# EAGLE design RomiboShield (EAGLE 5.11)
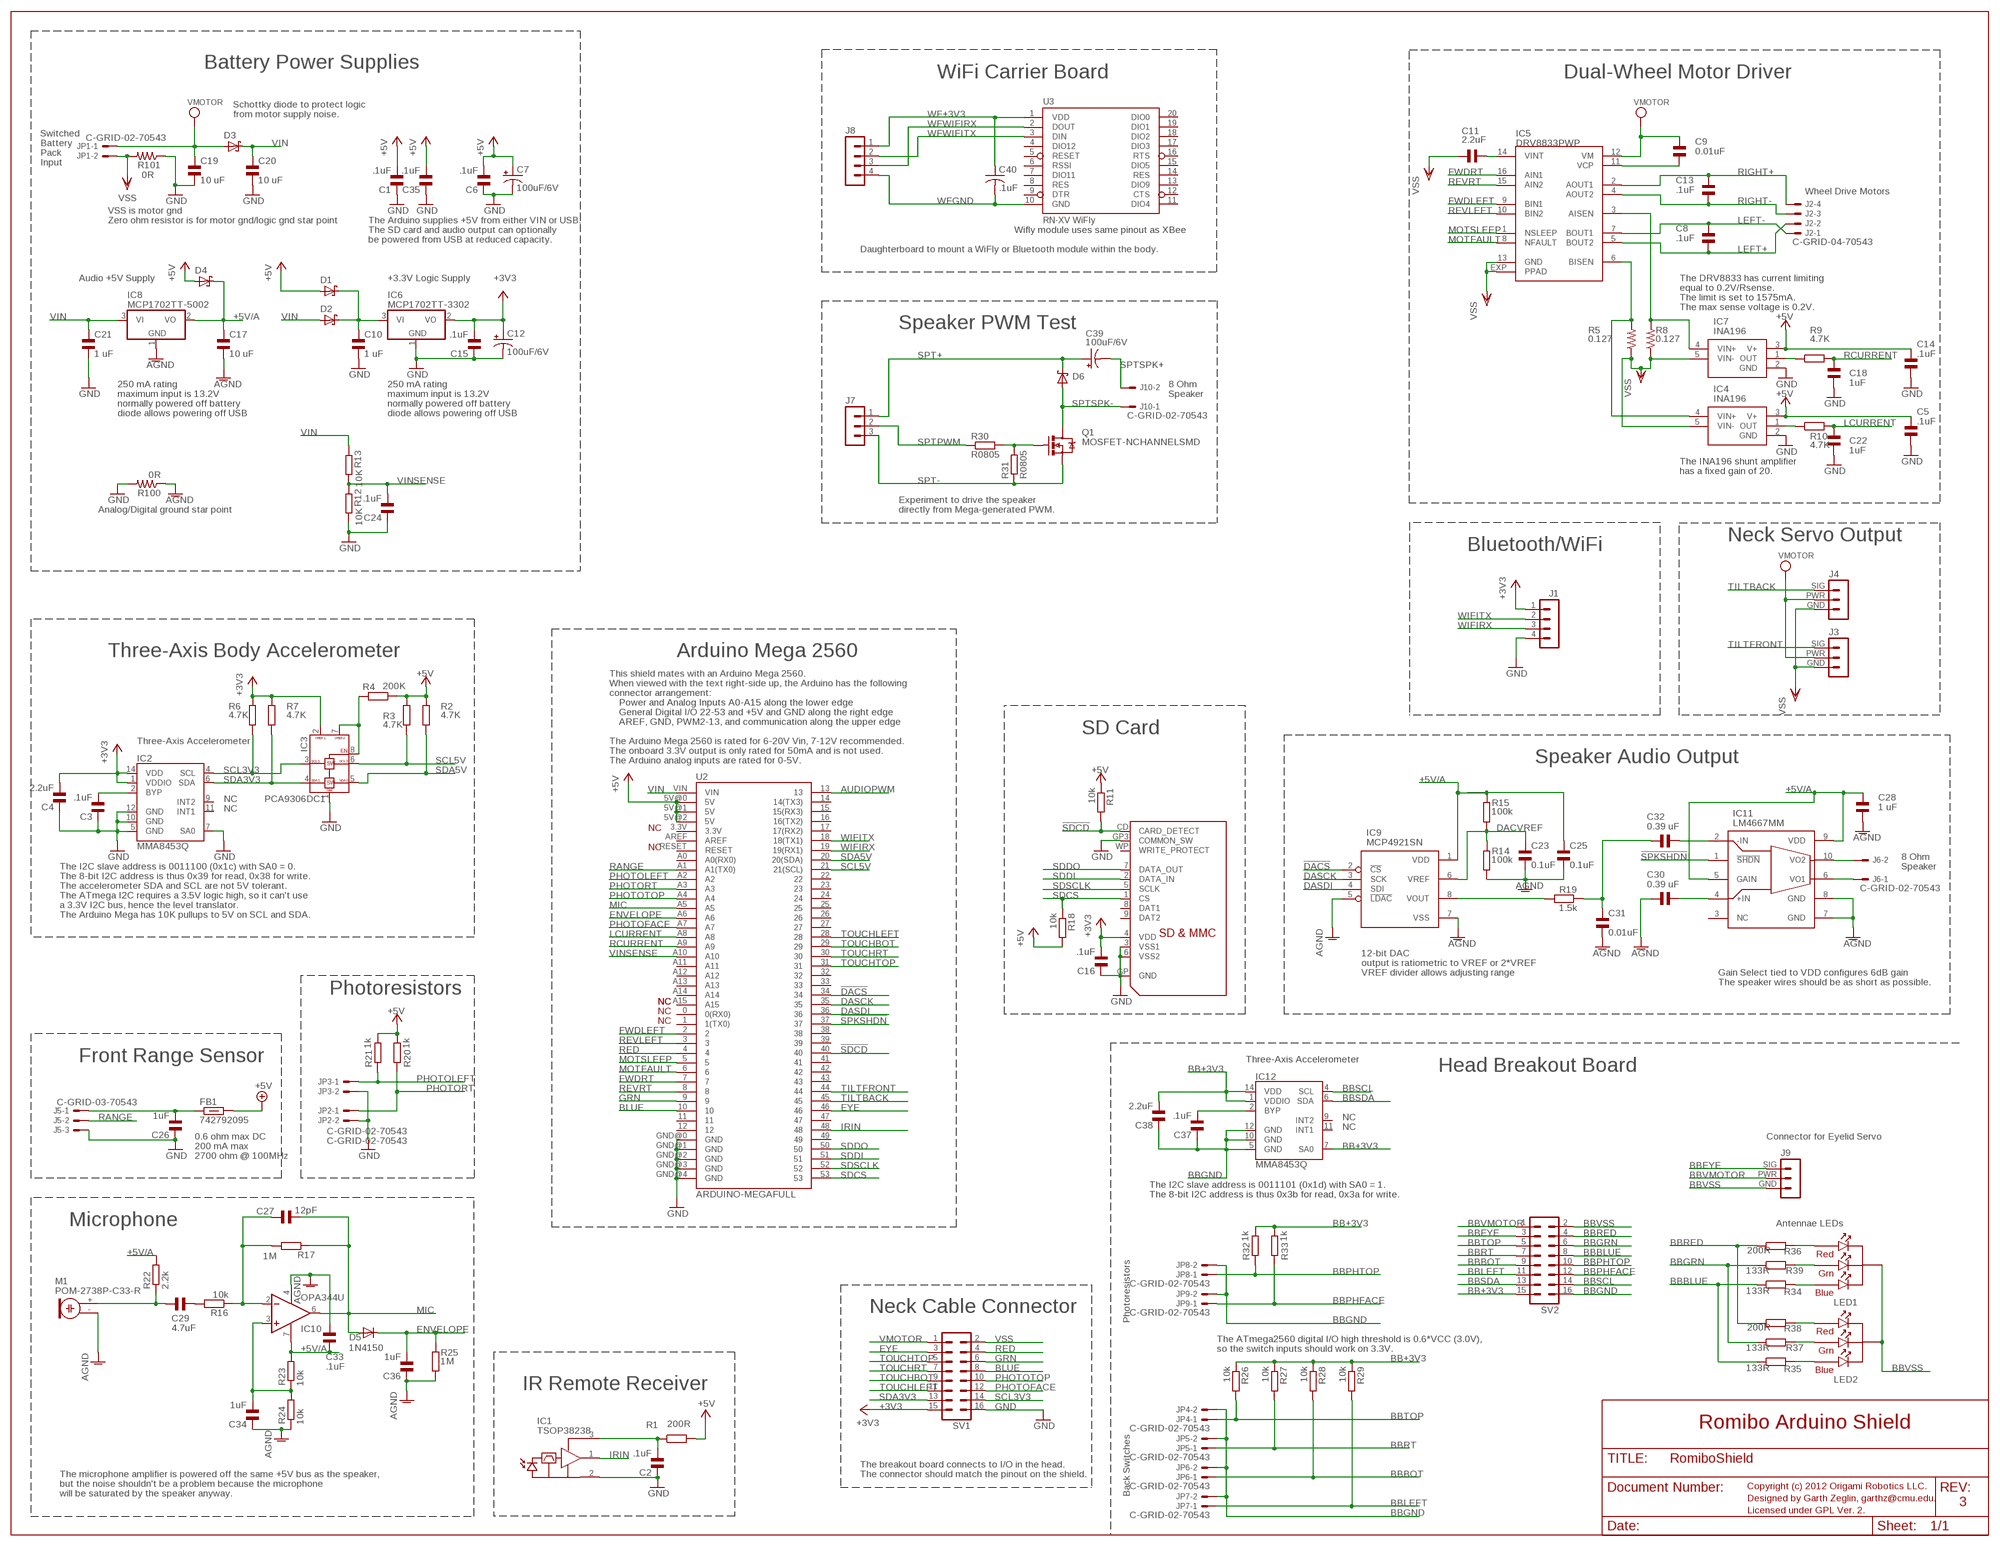
[diagram p0: schematic, sheet 1]

## Parts
C1  .1uF  C0805  [C0805]
C2  .1uF  C0805  [C0805]
C3  .1uF  C0805  [C0805]
C4  2.2uF  C0805  [C0805]
C5  .1uF  C0805  [C0805]
C6  .1uF  C0805  [C0805]
C7  100uF/6V  CPOL-USE2.5-5  [E2,5-5]
C8  .1uF  C0805  [C0805]
C9  0.01uF  C0805  [C0805]
C10  1 uF  C0805  [C0805]
C11  2.2uF  C0805  [C0805]
C12  100uF/6V  CPOL-USE2.5-5  [E2,5-5]
C13  .1uF  C0805  [C0805]
C14  .1uF  C0805  [C0805]
C15  .1uF  C0805  [C0805]
C16  .1uF  C0805  [C0805]
C17  10 uF  C0805  [C0805]
C18  1uF  C0805  [C0805]
C19  10 uF  C0805  [C0805]
C20  10 uF  C0805  [C0805]
C21  1 uF  C0805  [C0805]
C22  1uF  C0805  [C0805]
C23  0.1uF  C0805  [C0805]
C24  .1uF  C0805  [C0805]
C25  0.1uF  C0805  [C0805]
C26  1uF  C0805  [C0805]
C27  12pF  C0805  [C0805]
C28  1 uF  C0805  [C0805]
C29  4.7uF  C0805  [C0805]
C30  0.39 uF  C0805  [C0805]
C31  0.01uF  C0805  [C0805]
C32  0.39 uF  C0805  [C0805]
C33  .1uF  C0805  [C0805]
C34  1uF  C0805  [C0805]
C35  .1uF  C0805  [C0805]
C36  1uF  C0805  [C0805]
C37  .1uF  C0805  [C0805]
C38  2.2uF  C0805  [C0805]
C39  100uF/6V  CPOL-USE2.5-5  [E2,5-5]
C40  .1uF  C-USC0805  [C0805]
D1  MBR120  [SOD-123]
D2  MBR120  [SOD-123]
D3  MBR120  [SOD-123]
D4  MBR120  [SOD-123]
D5  1N4150  DIODE-SOD123  [SOD123]
D6  MBR130  [SOD-123]
FB1  742792095  FB0805  [FB0805]
IC1  TSOP38238  [TSOP382]
IC2  MMA8453Q  MMA8452Q  [QFN-16_0.5MM]
IC3  PCA9306DC1  [VSSOP8]
IC4  INA196  [SOT23-DBV]
IC5  DRV8833PWP  [HTSSOPPWP16]
IC6  MCP1702TT-3302  MCP1702TT  [SOT23]
IC7  INA196  [SOT23-DBV]
IC8  MCP1702TT-5002  MCP1702TT  [SOT23]
IC9  MCP4921SN  [SO-08]
IC10  OPA344U  [SO08]
IC11  LM4667MM  [MSOP-10]
IC12  MMA8453Q  MMA8452Q  [QFN-16_0.5MM]
J1  MA04-1F  [MA04-1F]
J2  C-GRID-04-70543  [70543-04]
J3  SERVOCONN  [SERVOCONN]
J4  SERVOCONN  [SERVOCONN]
J5  C-GRID-03-70543  [70543-03]
J6  C-GRID-02-70543  [70543-02]
J7  MA03-1F  [MA03-1F]
J8  MA04-1F  [MA04-1F]
J9  SERVOCONN  [SERVOCONN]
J10  C-GRID-02-70543  [70543-02]
JP1  C-GRID-02-70543  [70543-02]
JP2  C-GRID-02-70543  [70543-02]
JP3  C-GRID-02-70543  [70543-02]
JP4  C-GRID-02-70543  [70543-02]
JP5  C-GRID-02-70543  [70543-02]
JP6  C-GRID-02-70543  [70543-02]
JP7  C-GRID-02-70543  [70543-02]
JP8  C-GRID-02-70543  [70543-02]
JP9  C-GRID-02-70543  [70543-02]
LED1  RGBLED_CC-5MM  [LED5MMRGB]
LED2  RGBLED_CC-5MM  [LED5MMRGB]
M1  POM-2738P-C33-R  [POM-2738P-C33-R]
Q1  MOSFET-NCHANNELSMD  [SOT23-3]
R1  200R  R0603  [R0603]
R2  4.7K  R0603  [R0603]
R3  4.7K  R0603  [R0603]
R4  200K  R0603  [R0603]
R5  0.127  R-US_R1210  [R1210]
R6  4.7K  R0603  [R0603]
R7  4.7K  R0603  [R0603]
R8  0.127  R-US_R1210  [R1210]
R9  4.7K  R0603  [R0603]
R10  4.7K  R0603  [R0603]
R11  10k  R0603  [R0603]
R12  10K  R0603  [R0603]
R13  10K  R0603  [R0603]
R14  100k  R0603  [R0603]
R15  100k  R0603  [R0603]
R16  10k  R0603  [R0603]
R17  1M  R0603  [R0603]
R18  10k  R0603  [R0603]
R19  1.5k  R0603  [R0603]
R20  1k  R0603  [R0603]
R21  1k  R0603  [R0603]
R22  2.2k  R0603  [R0603]
R23  10k  R0603  [R0603]
R24  10k  R0603  [R0603]
R25  1M  R0603  [R0603]
R26  10k  R0603  [R0603]
R27  10k  R0603  [R0603]
R28  10k  R0603  [R0603]
R29  10k  R0603  [R0603]
R30  R0805  [R0805]
R31  R0805  [R0805]
R32  1k  R0603  [R0603]
R33  1k  R0603  [R0603]
R34  133R  R0603  [R0603]
R35  133R  R0603  [R0603]
R36  200R  R0603  [R0603]
R37  133R  R0603  [R0603]
R38  200R  R0603  [R0603]
R39  133R  R0603  [R0603]
R100  0R  R-US_R0805  [R0805]
R101  0R  R-US_R0805  [R0805]
SV1  ML16  [ML16]
SV2  ML16  [ML16]
U1  SDMMC06132  [06132]
U2  ARDUINO-MEGAFULL  [ARDUINO_MEGA]
U3  RN-XV WiFly  XBEE-1B2  [XBEE-SILK]

## Nets
3VREGIN: C10.2 D1.1(K) D2.1(K) IC6.3(VI)
!DACS: IC9.2(!CS!) U2.34
!SDCD: R11.2 U1.CD(CARD_DETECT) U2.40
!SPKSHDN: IC11.1(!SHDN!) U2.37
+3V3: C4.1 C12.+ C15.1 C16.1 IC2.1(VDDIO) IC2.14(VDD) IC3.2(VREF1) IC6.2(VO) J1.1 R6.2 R7.2 SV1.15 U1.4(VDD)
+5V: C1.1 C5.1 C6.1 C7.+ C14.1 C35.1 D1.2(A) D4.2(A) FB1.2 IC4.3(V+) IC7.3(V+) R1.2 R2.2 R3.2 R4.1 R11.1 R18.2 R20.2 R21.2 U2.5V@0(5V) U2.5V@1(5V) U2.5V@2(5V)
+5V/A: C17.2 C25.1 C28.1 C33.2 D4.1(K) IC8.2(VO) IC9.1(VDD) IC10.7(V+) IC11.5(GAIN) IC11.9(VDD) R15.1 R22.2 R23.2
AGND: C17.1 C23.2 C25.2 C28.2 C30.1 C31.2 C33.1 C34.2 C36.2 IC8.1(GND) IC9.5(!LDAC!) IC9.7(VSS) IC10.4(V-) IC11.7(GND) IC11.8(GND) M1.- R14.2 R24.1 R25.1 R100.1
ASENSE: IC5.3(AISEN) IC7.4(VIN+) R8.2
AUDIO: C31.1 C32.1 R19.1
AUDIOPWM: U2.13
BB+3V3: C38.1 IC12.1(VDDIO) IC12.7(SA0) IC12.14(VDD) R26.1 R27.1 R28.1 R29.1 R32.2 R33.2 SV2.15
BBBLUE: R34.1 R35.1 SV2.8
BBBOT: JP6.1 R28.2 SV2.9
BBBYP: C37.1 IC12.2(BYP)
BBEYE: J9.SIG SV2.3
BBGND: C37.2 C38.2 IC12.5(GND) IC12.10(GND) IC12.12(GND) JP4.2 JP5.2 JP6.2 JP7.2 JP8.2 JP9.2 SV2.16
BBGRN: R37.1 R39.1 SV2.6
BBLEFT: JP7.1 R29.2 SV2.11
BBPHFACE: JP9.1 R33.1 SV2.12
BBPHTOP: JP8.1 R32.1 SV2.10
BBRED: R36.1 R38.1 SV2.4
BBRT: JP5.1 R27.2 SV2.7
BBSCL: IC12.4(SCL) SV2.14
BBSDA: IC12.6(SDA) SV2.13
BBTOP: JP4.1 R26.2 SV2.5
BBVMOTOR: J9.PWR SV2.1
BBVSS: J9.GND LED1.2(COM) LED2.2(COM) SV2.2
BLUE: SV1.8 U2.10
BSENSE: IC4.4(VIN+) IC5.6(BISEN) R5.2
DACOUT: IC9.8(VOUT) R19.2
DACVREF: C23.1 IC9.6(VREF) R14.1 R15.2
DASCK: IC9.3(SCK) U2.35
DASDI: IC9.4(SDI) U2.36
ENVELOPE: C36.1 D5.C R25.2 U2.A6
EYE: SV1.3 U2.46
FWDLEFT: IC5.9(BIN1) U2.2
FWDRT: IC5.16(AIN1) U2.7
GND: C1.2 C2.2 C3.2 C4.2 C5.2 C6.2 C7.- C10.1 C12.- C14.2 C15.2 C16.2 C18.2 C19.1 C20.1 C21.1 C22.2 C24.2 C26.2 C35.2 IC1.2(GND) IC2.5(GND) IC2.7(SA0) IC2.10(GND) IC2.12(GND) IC3.1(GND) IC4.2(GND) IC6.1(GND) IC7.2(GND) J1.4 J5.3 JP2.2 JP3.2 R12.2 R100.2 R101.1 SV1.16 U1.3(VSS1) U1.6(VSS2) U1.GP3(COMMON_SW) U1.GP(GND) U2.GND@0(GND) U2.GND@1(GND) U2.GND@2(GND) U2.GND@3(GND) U2.GND@4(GND)
GRN: SV1.6 U2.9
IR+5V: C2.1 IC1.3(VS) R1.1
IRIN: IC1.1(OUT) U2.48
LCURRENT: C22.1 R10.2 U2.A8
LEFT+: C8.2 IC5.5(BOUT2) J2.2
LEFT-: C8.1 IC5.7(BOUT1) J2.1
LIOUT: IC7.1(OUT) R9.1
MIC: C27.1 D5.A IC10.6(OUT) R17.1 U2.A5
MIC+: C29.2 M1.+ R22.1
MICOP+: C34.1 IC10.3(+IN) R23.1 R24.2
MICOP-: C27.2 IC10.2(-IN) R16.1 R17.2
MOTFAULT: IC5.8(NFAULT) U2.6
MOTSLEEP: IC5.1(NSLEEP) U2.5
MOTVINT: C11.1 IC5.14(VINT)
N$1: C9.2 IC5.11(VCP)
N$4: IC3.7(VREF2) IC3.8(EN) R4.2
N$7: LED1.3(BLUE) R34.2
N$8: LED1.4(GREEN) R39.2
N$9: LED1.1(RED) R36.2
N$10: C3.1 IC2.2(BYP)
N$53: C29.1 R16.2
N$61: LED2.3(BLUE) R35.2
N$64: LED2.4(GREEN) R37.2
N$65: LED2.1(RED) R38.2
PHOTOFACE: SV1.12 U2.A7
PHOTOLEFT: JP3.1 R21.1 U2.A2
PHOTORT: JP2.1 R20.1 U2.A3
PHOTOTOP: SV1.10 U2.A4
RANGE: J5.2 U2.A1(A1(TX0))
RANGE+5V: C26.1 FB1.1 J5.1
RCURRENT: C18.1 R9.2 U2.A9
RED: SV1.4 U2.4
REVLEFT: IC5.10(BIN2) U2.3
REVRT: IC5.15(AIN2) U2.8
RIGHT+: C13.1 IC5.2(AOUT1) J2.4
RIGHT-: C13.2 IC5.4(AOUT2) J2.3
RIOUT: IC4.1(OUT) R10.1
SCL3V3: IC2.4(SCL) IC3.3(SCL1) R6.1 SV1.14
SCL5V: IC3.6(SCL2) R3.1 U2.21(21(SCL))
SDA3V3: IC2.6(SDA) IC3.4(SDA1) R7.1 SV1.13
SDA5V: IC3.5(SDA2) R2.1 U2.20(20(SDA))
SDCS: R18.1 U1.1(CS) U2.53
SDDI: U1.2(DATA_IN) U2.51
SDDO: U1.7(DATA_OUT) U2.50
SDSCLK: U1.5(SCLK) U2.52
SPK+: IC11.10(VO2) J6.2
SPK-: IC11.6(VO1) J6.1
SPKDRV+: C30.2 IC11.4(+IN)
SPKDRV-: C32.2 IC11.2(-IN)
SPKTBASE: Q1.1(G) R30.2 R31.2
SPT+: C39.+ D6.1(K) J7.1
SPT-: J7.3 Q1.2(S) R31.1
SPTPWM: J7.2 R30.1
SPTSPK+: C39.- J10.2
SPTSPK-: D6.2(A) J10.1 Q1.3(D)
TILTBACK: J4.SIG U2.45
TILTFRONT: J3.SIG U2.44
TOUCHBOT: SV1.9 U2.29
TOUCHLEFT: SV1.11 U2.28
TOUCHRT: SV1.7 U2.30
TOUCHTOP: SV1.5 U2.31
VIN: C20.2 C21.2 D2.2(A) D3.1(K) IC8.3(VI) R13.1 U2.VIN
VINSENSE: C24.1 R12.1 R13.2 U2.A10
VMOTOR: C9.1 C19.2 D3.2(A) IC5.12(VM) J3.PWR J4.PWR JP1.1 SV1.1
VSS: C11.2 IC4.5(VIN-) IC5.13(GND) IC5.EXP(PPAD) IC7.5(VIN-) J3.GND J4.GND JP1.2 R5.1 R8.1 R101.2 SV1.2
WF+3V3: C40.1 J8.1 U3.1(VDD)
WFGND: C40.2 J8.4 U3.10(GND)
WFWIFIRX: J8.3 U3.2(DOUT)
WFWIFITX: J8.2 U3.3(DIN)
WIFIRX: J1.3 U2.19(19(RX1))
WIFITX: J1.2 U2.18(18(TX1))
Unconnected: IC2.9(INT2) IC2.11(INT1) IC11.3(NC) IC12.9(INT2) IC12.11(INT1) U1.8(DAT1) U1.9(DAT2) U1.WP(WRITE_PROTECT) U2.0(0(RX0)) U2.1(1(TX0)) U2.3.3V U2.11 U2.12 U2.14(14(TX3)) U2.15(15(RX3)) U2.16(16(TX2)) U2.17(17(RX2)) U2.22 U2.23 U2.24 U2.25 U2.26 U2.27 U2.32 U2.33 U2.38 U2.39 U2.41 U2.42 U2.43 U2.47 U2.49 U2.A0(A0(RX0)) U2.A11 U2.A12 U2.A13 U2.A14 U2.A15 U2.AREF U2.RESET U3.4(DIO12) U3.5(RESET) U3.6(RSSI) U3.7(DIO11) U3.8(RES) U3.9(DTR) U3.11(DIO4) U3.12(CTS) U3.13(DIO9) U3.14(RES) U3.15(DIO5) U3.16(RTS) U3.17(DIO3) U3.18(DIO2) U3.19(DIO1) U3.20(DIO0)

## Notes on the sheet
- Battery Power Supplies
- WiFi Carrier Board | Dual-Wheel Motor Driver
- Schottky diode to protect logic
- from motor supply noise.
- Switched
- Battery
- Pack
- Input
- Wheel Drive Motors
- VSS is motor gnd
- Zero ohm resistor is for motor gnd/logic gnd star point | The Arduino supplies +5V from either VIN or USB.
- The SD card and audio output can optionally | Wifly module uses same pinout as XBee
- be powered from USB at reduced capacity.
- Daughterboard to mount a WiFly or Bluetooth module within the body.
- Audio +5V Supply | +3.3V Logic Supply | The DRV8833 has current limiting
- equal to 0.2V/Rsense.
- The limit is set to 1575mA.
- The max sense voltage is 0.2V.
- Speaker PWM Test
- 250 mA rating | 250 mA rating | 8 Ohm
- maximum input is 13.2V | maximum input is 13.2V | Speaker
- normally powered off battery | normally powered off battery
- diode allows powering off USB | diode allows powering off USB
- The INA196 shunt amplifier
- has a fixed gain of 20.
- Experiment to drive the speaker
- Analog/Digital ground star point | directly from Mega-generated PWM.
- Neck Servo Output
- Bluetooth/WiFi
- Three-Axis Body Accelerometer | Arduino Mega 2560
- This shield mates with an Arduino Mega 2560.
- When viewed with the text right-side up, the Arduino has the following
- connector arrangement:
- Power and Analog Inputs A0-A15 along the lower edge
- General Digital I/O 22-53 and +5V and GND along the right edge
- AREF, GND, PWM2-13, and communication along the upper edge
- SD Card
- Three-Axis Accelerometer | The Arduino Mega 2560 is rated for 6-20V Vin, 7-12V recommended.
- The onboard 3.3V output is only rated for 50mA and is not used.
- The Arduino analog inputs are rated for 0-5V. | Speaker Audio Output
- NC
- NC
- NC
- NC
- 8 Ohm
- The I2C slave address is 0011100 (0x1c) with SA0 = 0. | Speaker
- The 8-bit I2C address is thus 0x39 for read, 0x38 for write.
- The accelerometer SDA and SCL are not 5V tolerant.
- The ATmega I2C requires a 3.5V logic high, so it can't use
- a 3.3V I2C bus, hence the level translator.
- The Arduino Mega has 10K pullups to 5V on SCL and SDA.
- 12-bit DAC
- output is ratiometric to VREF or 2*VREF
- VREF divider allows adjusting range | Gain Select tied to VDD configures 6dB gain
- The speaker wires should be as short as possible.
- Photoresistors
- NC | NC
- NC
- NC
- Front Range Sensor | Three-Axis Accelerometer
- Head Breakout Board
- NC
- NC
- 0.6 ohm max DC | Connector for Eyelid Servo
- 200 mA max
- 2700 ohm @ 100MHz
- The I2C slave address is 0011101 (0x1d) with SA0 = 1.
- The 8-bit I2C address is thus 0x3b for read, 0x3a for write.
- Microphone | Antennae LEDs
- Neck Cable Connector
- Photoresistors
- The ATmega2560 digital I/O high threshold is 0.6*VCC (3.0V),
- so the switch inputs should work on 3.3V.
- IR Remote Receiver
- Romibo Arduino Shield
- The breakout board connects to I/O in the head.
- The microphone amplifier is powered off the same +5V bus as the speaker, | The connector should match the pinout on the shield.
- but the noise shouldn't be a problem because the microphone | Copyright (c) 2012 Origami Robotics LLC.
- will be saturated by the speaker anyway. | Back Switches
- Designed by Garth Zeglin, garthz@cmu.edu.
- 3
- Licensed under GPL Ver. 2.

## Library data of the parts
C1-C6 C8-C11 C13-C38 = Romibo:C0805
C7 C12 C39 = adafruit:CPOL-US: POLARIZED CAPACITOR, American symbol
C40 = rcl:C-US: CAPACITOR, American symbol
D1-D4 = Romibo:MBR*
D5 = diode:DIODE-: DIODE
D6 = MISC:MBR130
FB1 = Romibo:FB: Ferrite bead
IC1 = Romibo:TSOP382*: IR Receiver for Remote Control Systems Vishay TSOP38238, etc.; CARRIER: 38
IC2 IC12 = Romibo:MMA8452Q: MMA8452Q 3-Axis, 12/8-bit Digital Accelerometer Supply Voltage: 1.6-3.6V Range: +/- 2g, 4g, 8g Interface: I2C, 12-bit and 8-bit ODR: 1.56 Hz - 800 Hz Package: QFN-16 http://cache.freescale.com/files/sensors/doc/data_sheet/MMA8452Q.pdf MMA8453Q 3-Axis, 10/8-bit Digital Accelerometer Identical package to MMA8452Q cache.freescale.com/files/sensors/doc/data_sheet/MMA8453Q.pdf Original part copied from Sparkfun library.
IC3 = Romibo:PCA9306: Dual bidirectional I2C bus and SMBus voltage-level translator. NXP and ONsemi both make pin compatible versions. DCT and DCU are TI packages DP1 and DC1 are NXP pin compatible parts
IC4 IC7 = Romibo:INA196
IC5 = Romibo:DRV8833PWP: Dual H-Bridge Motor Driver, 1.5A RMS, 2.0A Peak, 2.7-10.8V Supply
IC6 IC8 = Romibo:MCP17*: Low-Dropout Regulators MCP1702: 250mA output, input 2.7 to 13.2V, outputs available 1.2 to 5.0V MCP1700: 250mA output, input 2.3 to 6.0V, outputs available 1.2 to 5.0V
IC9 = Romibo:MCP4921
IC10 = linear:OPA*: Single Operational Amplifier Low Power, Single-Supply, Rail-To-Rail Operational Amplifier Source: http://focus.ti.com/lit/ds/symlink/opa2345.pdf
IC11 = Romibo:LM4667: Filterless High Efficiency 1.3W Switching Audio Amplifier (class-D)
J1 J8 = Molex-KK1:MA04-1F
J2 = con-molex:C-GRID-04: CONNECTOR wire to board 2.54 mm (0.100") pitch header; OC_FARNELL: unknown; OC_NEWARK: unknown
J3 J4 J9 = Romibo:SERVOCONN
J5 = con-molex:C-GRID-03: CONNECTOR wire to board 2.54 mm (0.100") pitch header; OC_FARNELL: unknown; OC_NEWARK: unknown
J6 J10 JP1-JP9 = con-molex:C-GRID-02: CONNECTOR wire to board 2.54 mm (0.100") pitch header; OC_FARNELL: unknown; OC_NEWARK: unknown
J7 = Molex-KK1:MA03-1F
LED1 LED2 = Romibo:RGBLED_CC: RGB LED, common-cathode, 5MM body, staggered through-hole pins Based on Kingbright WP154A4SUREPBGVGAW
M1 = Romibo:POM-2738P-C33-R: PUI Audio Electret Condenser Microphone
Q1 = SparkFun:MOSFET-NCHANNEL
R1-R4 R6 R7 R9-R29 R32-R39 = Romibo:R0603
R5 R8 R100 R101 = rcl:R-US_: RESISTOR, American symbol
R30 R31 = COMMON:R0805
SV1 SV2 = con-harting-ml:ML16: HARTING; OC_FARNELL: unknown; OC_NEWARK: unknown
U1 = adafruit:SDMMC: SD MMC Card holder 4UCON part #06132 - easy to solder
U2 = SparkFun:ARDUINO-MEGA: Arduino Mega footprint connections
U3 = SparkFun:XBEE-1

## Board
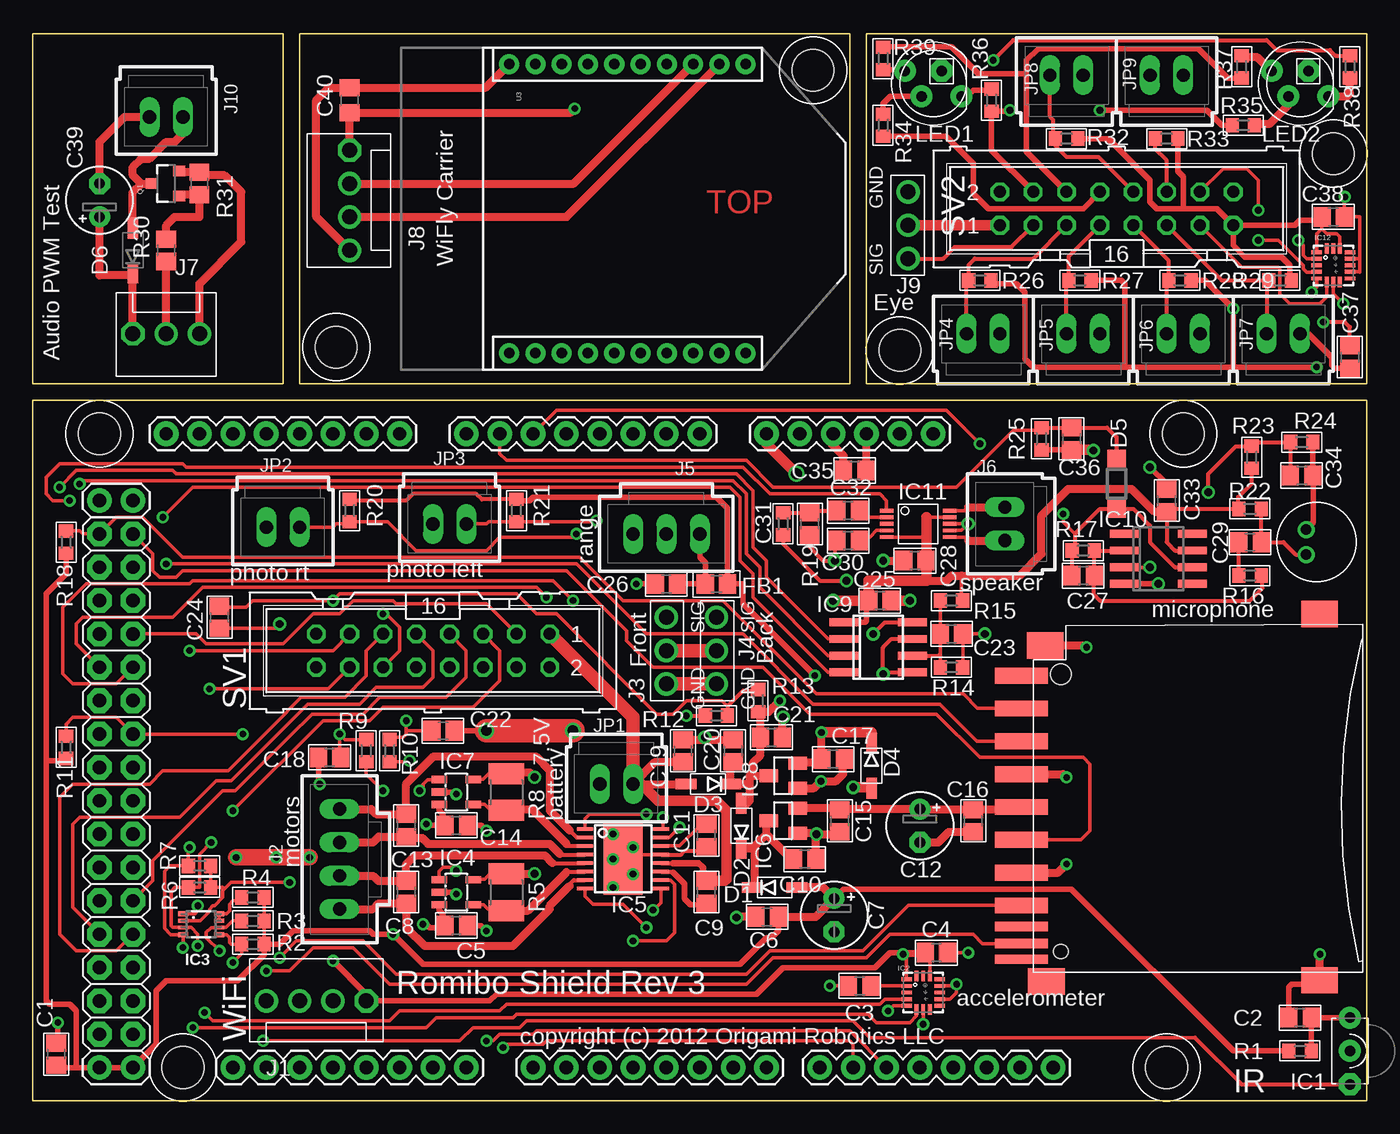
[diagram p1: board, top side]
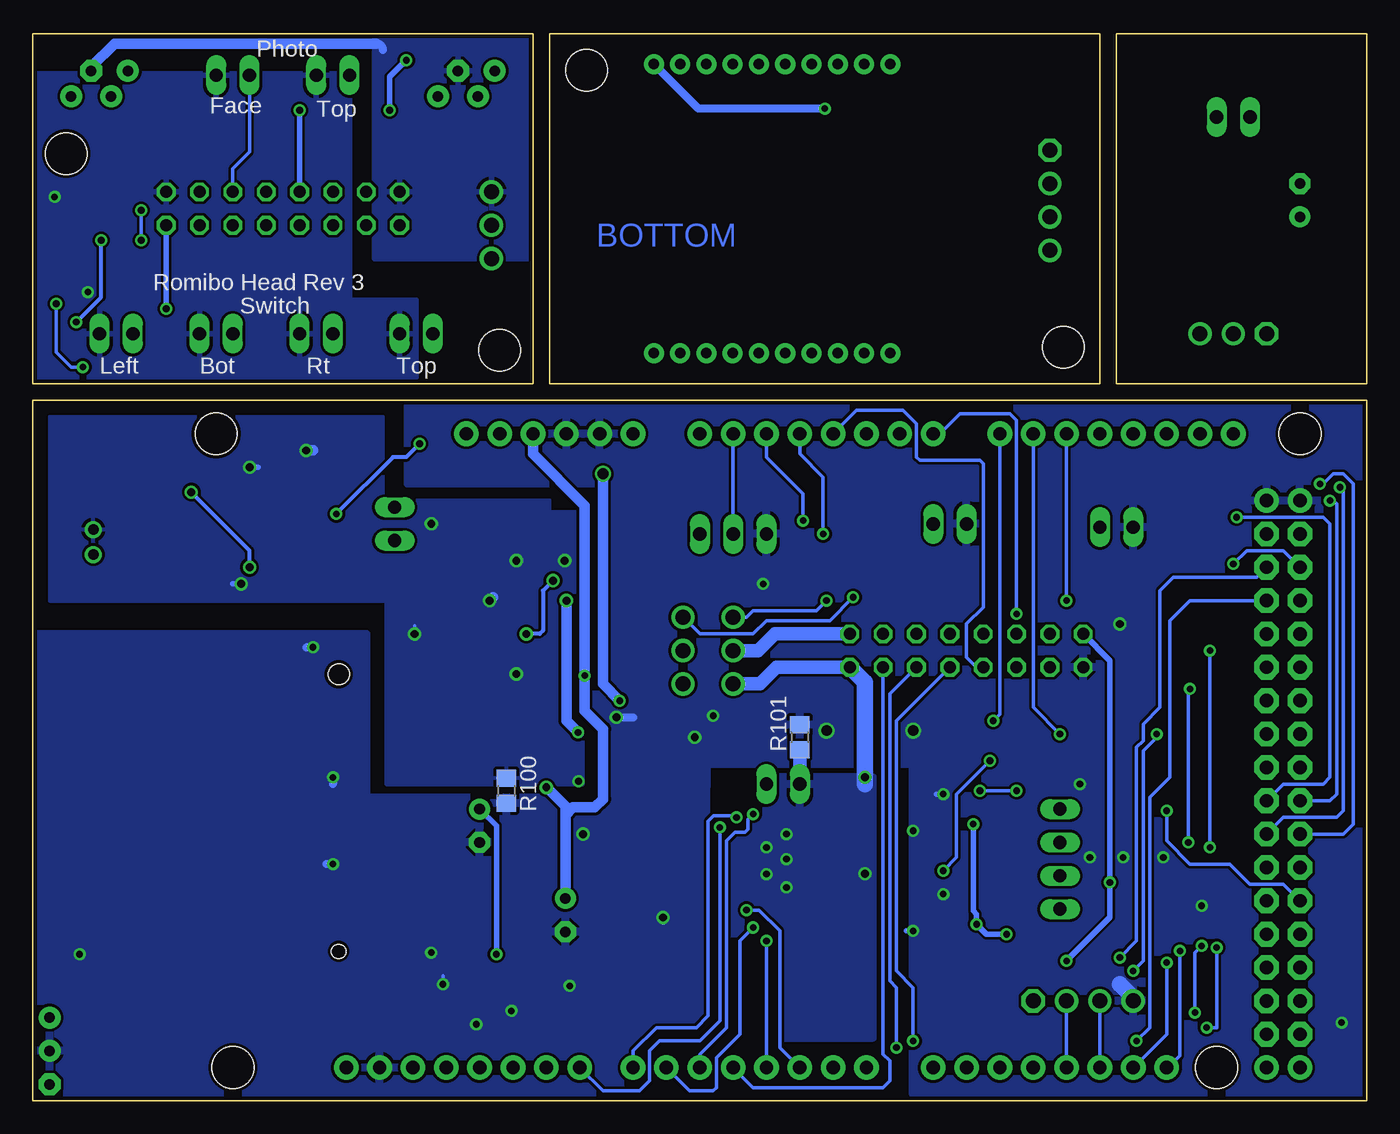
[diagram p2: board, bottom side, seen from below]

Size 101.6 x 81.28 mm. Coordinates in mm from the lower left corner, seen from the top.
Outline: 101.6,53.34 0,53.34 0,0 101.6,0 101.6,53.34
Outline: 101.6,81.28 63.5,81.28 63.5,54.61 101.6,54.61 101.6,81.28
Outline: 62.23,54.61 62.23,81.28 20.32,81.28 20.32,54.61 62.23,54.61
Outline: 19.05,54.61 19.05,81.28 0,81.28 0,54.61 19.05,54.61
Copper layers (1*16): Top 0.035mm / dielectric 1.5mm / Bottom 0.035mm
Design rules "Advanced-Circuits-design-rules *": minimum track width 8mil, minimum drill 15mil, track to track 8mil, track to pad 8mil, pad to pad 8mil, via to via 8mil, smd to smd 8mil, copper to edge 10mil, drill to drill 8mil, minimum pad ring 10mil, minimum via ring 8mil, stop-mask expansion 4mil, vias tented up to drill 0mil, thermal gap 10mil
Holes 3.17 mm at 99.06,72.14 66.04,57.15 23.11,57.4 59.44,78.49
bKeepout: 4 lines

### Footprints (pad centres in the part's own frame; a part is rotated, then mirrored left to right if it is on the bottom)
C0805 = smd 1.3 x 1.5: 1 -0.85,0; 2 0.85,0
E2,5-5 = drill 0.813 pad 1.6 round: + -1.27,0 | drill 0.813 pad 1.6 octagon: - 1.27,0
C0805' = smd 1.3 x 1.5: 1 -0.95,0; 2 0.95,0
SOD-123 = smd 1.6 x 0.8: 1 -1.7,0; 2 1.7,0
SOD123 = smd 1.4 x 1.4: A 1.9,0; C -1.9,0
FB0805 = smd 1.3 x 1.5: 1 -0.85,0; 2 0.85,0
TSOP382 = drill 0.8 pad 1.676 octagon: 1 -2.54,0 | drill 0.8 pad 1.676 round: 2 0,0; 3 2.54,0
QFN-16_0.5MM = smd 0.8 x 0.295: 1 -1.275,1; 2 -1.275,0.5; 3 -1.275,0; 4 -1.275,-0.5; 5 -1.275,-1; 9 1.275,-1; 10 1.275,-0.5; 11 1.275,0; 12 1.275,0.5; 13 1.275,1 | smd 0.295 x 0.8: 6 -0.5,-1.275; 7 0,-1.275; 8 0.5,-1.275; 14 0.5,1.275; 15 0,1.275; 16 -0.5,1.275
VSSOP8 = smd 0.395 x 0.75: 1 -0.8,-1.375; 4 0.8,-1.375; 5 0.8,1.375; 8 -0.8,1.375 | smd 0.295 x 0.75: 2 -0.25,-1.375; 3 0.25,-1.375; 6 0.25,1.375; 7 -0.25,1.375
SOT23-DBV = smd 0.55 x 1.2: 1 -0.95,-1.3; 2 0,-1.3; 3 0.95,-1.3; 4 0.95,1.3; 5 -0.95,1.3
HTSSOPPWP16 = smd 0.27 x 1.2: 1 -2.275,-2.9; 2 -1.625,-2.9; 3 -0.975,-2.9; 4 -0.325,-2.9; 5 0.325,-2.9; 6 0.975,-2.9; 7 1.625,-2.9; 8 2.275,-2.9; 9 2.275,2.9; 10 1.625,2.9; 11 0.975,2.9; 12 0.325,2.9; 13 -0.325,2.9; 14 -0.975,2.9; 15 -1.625,2.9; 16 -2.275,2.9 | smd 5.5 x 3: EXP 0,0
SOT23 = smd 1 x 1.4: 1 -0.95,-1.1; 2 0.95,-1.1; 3 0,1.1
SO-08 = smd 0.6 x 2.2: 1 -1.905,-2.6; 2 -0.635,-2.6; 3 0.635,-2.6; 4 1.905,-2.6; 5 1.905,2.6; 6 0.635,2.6; 7 -0.635,2.6; 8 -1.905,2.6
SO08 = smd 0.6 x 2.2: 1 -1.905,-2.6; 2 -0.635,-2.6; 3 0.635,-2.6; 4 1.905,-2.6; 5 1.905,2.6; 6 0.635,2.6; 7 -0.635,2.6; 8 -1.905,2.6
MSOP-10 = smd 1.02 x 0.29: 1 -2.4,1; 2 -2.4,0.5; 3 -2.4,0; 4 -2.4,-0.5; 5 -2.4,-1; 6 2.4,-1; 7 2.4,-0.5; 8 2.4,0; 9 2.4,0.5; 10 2.4,1
MA04-1F = drill 1.143 pad 1.778 octagon: 1 7.62,0 | drill 1.143 pad 1.778 round: 2 5.08,0; 3 2.54,0; 4 0,0
70543-04 = drill 1.016 long: 1 -3.81,0; 2 -1.27,0; 3 1.27,0; 4 3.81,0
SERVOCONN = drill 1.143 pad 1.778 round: GND 2.54,0; PWR 0,0; SIG -2.54,0
70543-03 = drill 1.016 long: 1 -2.54,0; 2 0,0; 3 2.54,0
70543-02 = drill 1.016 long: 1 -1.27,0; 2 1.27,0
MA03-1F = drill 1.143 pad 1.778 octagon: 1 5.08,0 | drill 1.143 pad 1.778 round: 2 2.54,0; 3 0,0
LED5MMRGB = drill 0.8 pad 1.676 round: 1 -2.159,0.968; 3 0.889,0.968; 4 2.159,-0.968 | drill 0.8 pad 1.676 octagon: 2 -0.635,-0.968
POM-2738P-C33-R = drill 0.8 round: + -0.95,0.8; - 0.95,0.8
SOT23-3 = smd 0.8 x 0.9: 1 -0.95,-1; 2 0.95,-1; 3 0,1.1
R0603 = smd 1 x 1.1: 1 -0.85,0; 2 0.85,0
R1210 = smd 1.6 x 2.7: 1 -1.4,0; 2 1.4,0
R0805 = smd 1.3 x 1.5: 1 -0.85,0; 2 0.85,0
R0805' = smd 1.3 x 1.5: 1 -0.95,0; 2 0.95,0
ML16 = drill 0.914 octagon: 1 -8.89,-1.27; 2 -8.89,1.27; 3 -6.35,-1.27; 4 -6.35,1.27; 5 -3.81,-1.27; 6 -3.81,1.27; 7 -1.27,-1.27; 8 -1.27,1.27; 9 1.27,-1.27; 10 1.27,1.27; 11 3.81,-1.27; 12 3.81,1.27; 13 6.35,-1.27; 14 6.35,1.27; 15 8.89,-1.27; 16 8.89,1.27
06132 = smd 1.2 x 4: 1 6.9,0.9; 2 4.4,0.9; 3 1.9,0.9; 4 -0.6,0.9; 5 -3.1,0.9; 6 -5.6,0.9; 7 -8.1,0.9; 9 9.4,0.9 | smd 0.7 x 4: 8 -9.7,0.9; CD -11,0.9; WP -12.2,0.9 | smd 2 x 2.8: GP -13.8,-21.8; GP2 14.1,-21.8; GP3 11.7,-0.9; GP4 -13.9,-1 | hole 1.1: -11.6,-2.1 | hole 1.6: 9.5,-2.1
ARDUINO_MEGA = drill 1.016 pad 1.88 round: 0 63.5,50.8; 1 60.96,50.8; 2 58.42,50.8; 3 55.88,50.8; 3.3V 35.56,2.54; 4 53.34,50.8; 5 50.8,50.8; 5V@0 38.1,2.54; 5V@1 93.98,50.8; 5V@2 96.52,50.8; 6 48.26,50.8; 7 45.72,50.8; 8 41.656,50.8; 9 39.116,50.8; 10 36.576,50.8; 11 34.036,50.8; 12 31.496,50.8; 13 28.956,50.8; 14 68.58,50.8; 15 71.12,50.8; 16 73.66,50.8; 17 76.2,50.8; 18 78.74,50.8; 19 81.28,50.8; 20 83.82,50.8; 21 86.36,50.8; A0 50.8,2.54; A1 53.34,2.54; A2 55.88,2.54; A3 58.42,2.54; A4 60.96,2.54; A5 63.5,2.54; A6 66.04,2.54; A7 68.58,2.54; A8 73.66,2.54; A9 76.2,2.54; A10 78.74,2.54; A11 81.28,2.54; A12 83.82,2.54; A13 86.36,2.54; A14 88.9,2.54; A15 91.44,2.54; AREF 23.876,50.8; GND@0 40.64,2.54; GND@1 43.18,2.54; GND@2 93.98,7.62; GND@3 96.52,7.62; GND@4 26.416,50.8; RESET 33.02,2.54; VIN 45.72,2.54 | drill 1.016 pad 1.88 octagon: 22 93.98,48.26; 23 96.52,48.26; 24 93.98,45.72; 25 96.52,45.72; 26 93.98,43.18; 27 96.52,43.18; 28 93.98,40.64; 29 96.52,40.64; 30 93.98,38.1; 31 96.52,38.1; 32 93.98,35.56; 33 96.52,35.56; 34 93.98,33.02; 35 96.52,33.02; 36 93.98,30.48; 37 96.52,30.48; 38 93.98,27.94; 39 96.52,27.94; 40 93.98,25.4; 41 96.52,25.4; 42 93.98,22.86; 43 96.52,22.86; 44 93.98,20.32; 45 96.52,20.32; 46 93.98,17.78; 47 96.52,17.78; 48 93.98,15.24; 49 96.52,15.24; 50 93.98,12.7; 51 96.52,12.7; 52 93.98,10.16; 53 96.52,10.16 | hole 3.2: 15.24,50.8; 13.97,2.54; 90.17,50.8; 96.52,2.54
XBEE-SILK = drill 0.8 pad 1.524 round: 1 -11,20; 2 -11,18; 3 -11,16; 4 -11,14; 5 -11,12; 6 -11,10; 7 -11,8; 8 -11,6; 9 -11,4; 10 -11,2; 11 11,2; 12 11,4; 13 11,6; 14 11,8; 15 11,10; 16 11,12; 17 11,14; 18 11,16; 19 11,18; 20 11,20

### Placement (x,y rotation side)
C1  1.78,3.56 90 top
C2  96.52,6.35 180 top
C3  62.99,8.76 180 top
C4  68.83,11.3 0 top
C5  32.26,13.36 0 top
C6  55.93,14.02 180 top
C7  61.04,14.15 270 top
C8  28.45,15.9 90 top
C9  51.31,15.9 270 top
C10  58.8,18.41 180 top
C11  51.31,20.22 270 top
C12  67.56,20.95 270 top
C13  28.45,20.98 270 top
C14  32.26,20.98 0 top
C15  61.47,21.34 270 top
C16  71.63,21.34 270 top
C17  60.96,26.04 180 top
C18  22.61,26.16 180 top
C19  49.53,26.67 270 top
C20  53.34,26.67 270 top
C21  56.26,27.69 180 top
C22  31.24,28.19 0 top
C23  69.98,35.56 0 top
C24  14.22,36.83 270 top
C25  64.52,38.1 0 top
C26  48.26,39.37 180 top
C27  80.01,40.01 0 top
C28  67.18,41.15 180 top
C29  92.71,42.55 0 top
C30  62.1,42.67 0 top
C31  59.18,43.94 270 top
C32  62.1,44.96 0 top
C33  86.36,45.72 270 top
C34  96.65,47.62 0 top
C35  62.61,48.01 180 top
C36  79.12,50.42 270 top
C37  100.33,56.64 270 top
C38  99.06,67.31 0 top
C39  5.08,68.58 90 top
C40  .1uF  [C0805']  24.13,76.2 90 top
D1  56.52,16.26 0 top
D2  53.98,20.95 90 top
D3  51.44,24.13 180 top
D4  63.88,25.53 270 top
D5  82.55,46.99 270 top
D6  7.62,64.77 90 top
FB1  52.07,39.37 0 top
IC1  100.33,3.81 90 top
IC2  67.82,8.26 0 top
IC3  12.83,13.46 270 top
IC4  32.26,15.9 270 top
IC5  44.96,18.44 270 top
IC6  57.15,21.34 90 top
IC7  32.26,23.52 270 top
IC8  57.15,24.77 90 top
IC9  64.39,34.54 270 top
IC10  85.72,41.27 270 top
IC11  67.44,43.94 0 top
IC12  99.06,63.63 0 top
J1  17.78,7.62 0 top
J2  23.37,18.41 90 top
J3  48.26,34.29 270 top
J4  52.07,34.29 270 top
J5  48.26,43.18 180 top
J6  74.04,43.94 90 top
J7  12.7,58.42 180 top
J8  24.13,64.77 90 top
J9  66.67,66.67 90 top
J10  10.16,74.93 180 top
JP1  44.45,24.13 180 top
JP2  19.05,43.69 180 top
JP3  31.75,43.94 180 top
JP4  72.39,58.42 0 top
JP5  80.01,58.42 0 top
JP6  87.63,58.42 0 top
JP7  95.25,58.42 0 top
JP8  78.74,78.11 0 top
JP9  86.36,78.11 0 top
LED1  68.58,77.47 180 top
LED2  96.52,77.47 180 top
M1  97.79,42.55 90 top
Q1  10.16,69.85 90 top
R1  96.52,3.81 180 top
R2  16.76,11.94 0 top
R3  16.76,13.72 0 top
R4  16.76,15.49 180 top
R5  36.07,15.9 270 top
R6  12.7,16.26 0 top
R7  12.7,17.91 0 top
R8  36.07,23.52 270 top
R9  25.4,26.67 90 top
R10  27.18,26.67 90 top
R11  2.54,26.92 90 top
R12  52.07,29.34 180 top
R13  55.24,30.48 90 top
R14  69.98,33.02 0 top
R15  69.98,38.1 180 top
R16  92.71,40.01 180 top
R17  80.01,41.91 0 top
R18  2.54,42.55 270 top
R19  57.15,43.94 270 top
R20  24.13,44.96 90 top
R21  36.83,44.96 90 top
R22  92.71,45.09 180 top
R23  92.84,49.02 270 top
R24  96.65,50.16 180 top
R25  76.83,50.42 90 top
R26  72.14,62.48 180 top
R27  79.76,62.48 180 top
R28  87.38,62.48 180 top
R29  95,62.48 180 top
R30  10.16,64.77 90 top
R31  12.7,69.85 270 top
R32  78.74,73.28 0 top
R33  86.36,73.28 0 top
R34  64.77,74.3 90 top
R35  92.2,74.3 0 top
R36  73.03,76.2 90 top
R37  92.08,78.74 90 top
R38  100.33,78.74 270 top
R39  64.77,79.38 270 top
R100  0R  [R0805']  65.53,23.62 270 bottom
R101  0R  [R0805']  43.18,27.69 270 bottom
SV1  30.48,34.29 180 top
SV2  82.55,67.94 0 top
U1  76.2,22.99 90 top
U2  101.6,53.34 180 top
U3  34.29,67.94 270 top

### Tracks (layer width: path | path; a pad name or v marks a point on that pad's centre or on a via)
3VREGIN
  Top 0.61: D1.1 54.99,16.26 54.99,19.25 D2.1 54.81,19.25 55.88,20.32 | 55.88,20.32 55.88,21.17 IC6.3 | C10.2 57.78,18.41 55.88,20.32
!DACS  (via drill 0.51)
  Top 0.254: IC9.2 60.58,35.18 55.88,39.88 55.88,41.15 54.86,42.16 54.86,46.48 53.59,47.75 10.92,47.75 10.67,48.01 3.3,48.01 v2.03,46.74
  Bottom 0.254: U2.34 6.35,21.59 2.29,21.59 1.78,22.1 1.78,46.48 v2.03,46.74
!SDCD  (via drill 0.51)
  Top 0.254: R11.2 2.54,28.7 3.05,29.21 6.35,29.21 U2.40 v16,27.94 | v17.78,9.91 19.56,9.91 21.34,11.68 24.38,11.68 27.18,8.89 54.36,8.89 56.39,10.92 63.5,10.92 65.28,12.7 71.63,12.7 72.34,11.99 U1.CD
  Bottom 0.254: v17.78,9.91 17.02,10.67 17.02,26.67 16,27.69 v16,27.94
!SPKSHDN  (via drill 0.51)
  Top 0.254: IC11.1 65.02,44.95 65.02,45.72 64.52,46.23 56.13,46.23 54.1,48.26 11.68,48.26 11.43,48.51 2.03,48.51 1.02,47.5 1.02,46.23 1.52,45.72 v2.79,45.72
  Bottom 0.254: U2.37 2.79,22.86 2.29,23.37 2.29,45.47 2.54,45.72 v2.79,45.72
+3V3  (via drill 0.51)
  Top 0.254: IC2.14 68.32,10.97 C4.1 | IC2.1 66.54,11.04 66.8,11.3 C4.1 | R7.2 R6.2 14.48,16.26 14.48,16 | C4.1 68.07,11.39 | IC3.2 12.58,13.71 12.58,13.72 12.74,13.72 13.46,14.43 13.46,14.61 13.72,14.86 13.84,14.86 14.48,15.49 14.48,16 | 14.48,16 15.11,16.64 v19.56,16.64
  Top 0.406: C4.1 65.28,11.3 64.14,10.16 57.15,10.16 55.12,8.13 35.31,8.13 34.8,7.62 J1.1 25.4,8.13 v22.86,10.67 | 66.54,11.04 66.41,11.18 v66.29,11.18 68.07,11.18 68.07,11.39
  Top 0.508: 75.08,22.23 U1.4
  Top 0.61: IC6.2 61.37,22.29 C15.1 61.51,22.23 C12.+ 71.59,22.23 C16.1 71.67,22.23 75.08,22.23
  Bottom 0.406: SV1.15 19.56,33.53 v19.56,16.64 19.56,13.97 v22.86,10.67 | v66.29,11.18 66.29,20.95 C12.+
+5V  (via drill 0.51, 0.6)
  Top 0.254: R2.2 R3.2 R4.1
  Top 0.305: R21.2 34.2,45.81 33.78,46.23 28.96,46.23 28.45,45.72 24.22,45.72
  Top 0.406: R1.2 91.44,3.81 79.12,16.13 61.75,16.13 C7.+ | C1.1 1.78,2.54 1.79,2.53 3.3,2.53 | 3.3,2.53 5.07,2.53 U2.5V@2 U2.5V@1 9.4,4.32 9.4,8.38 10.16,9.14 15.62,9.14 17.61,11.14 R2.2 18.8,11.94 19.81,12.95 25.65,12.95 25.91,12.7 v27.43,12.7 29.72,10.41 53.85,10.41 55.88,12.45 56.26,12.45 56.79,12.98 56.79,14.01 C6.1 | R21.2 36.92,45.72 37.85,45.72 38.1,45.97 52.07,45.97 52.92,45.12 FB1.2 54.1,39.37 54.1,37.85 v59.56,32.38 | 24.22,45.72 R20.2 | IC7.3 30.96,22.13 31.24,21.84 31.24,21.05 C14.1 30.07,20.98 v29.97,21.08 | IC4.3 30.96,14.51 31.24,14.22 31.24,13.43 C5.1 31.16,13.21 30.23,13.21 29.97,13.46 v29.72,13.46 | R18.2 2.54,40.13 1.02,38.61 1.02,25.91 | 1.02,25.91 1.02,7.62 1.27,7.37 2.79,7.37 3.3,6.86 3.3,2.53 | R11.1 2.37,25.91 1.02,25.91
  Top 0.61: C35.1 63.46,50.76 U2.5V@0 | D1.2 60.2,16.26 C7.+ 59.64,14.02 C6.1
  Top 0.813: v62.48,23.88 63.83,23.88 D4.2
  Bottom 0.406: v29.97,21.08 29.97,14.48 29.72,14.22 v29.72,13.46 28.96,12.7 v27.43,12.7
  Bottom 0.813: U2.5V@0 63.5,49.28 59.56,45.34 v59.56,32.38 59.56,29.72 58.17,28.32 58.17,22.99 58.8,22.35 60.45,22.35 61.04,21.77 | 61.14,15.42 C7.+ 61.04,21.77 | 61.04,21.77 61.04,22.43 v62.48,23.88
+5V/A  (via drill 0.51, 0.6)
  Top 0.254: 68.07,44.44 IC11.9 | IC11.5 68.07,42.94 68.07,42.67 | R15.1 70.74,38.16 70.74,40.01
  Top 0.305: R23.2 92.84,46.99 91.82,45.97 91.82,45.02 R22.2 86.58,45.09 C33.2 86.36,42.55 87,41.91 IC10.7 | 68.07,44.44 68.07,44.58
  Top 0.406: IC9.1 63.37,36.45 63.5,36.58 63.5,38.19 C25.1
  Top 0.61: 86.36,44.83 C33.2 85.43,44.87 83.69,46.61 78.87,46.61 76.83,44.58 76.83,41.66 75.18,40.01 70.74,40.01 69.98,40.01 69.6,39.62 68.07,39.62 | v60.07,28.07 60.07,26.04 C17.2 60.35,25.78 58.29,25.78 IC8.2
  Top 0.813: 68.07,44.44 68.07,42.67 68.07,41.15 | v60.96,38.1 C25.1 63.67,39.62 68.07,39.62 68.07,41.15 | 68.07,41.15 C28.1 | D4.1 63.88,28.07 v60.07,28.07
  Bottom 0.61: v60.07,28.07 59.94,27.94
  Bottom 0.813: v60.07,28.07 60.96,28.96 v60.96,38.1
AGND  (via drill 0.51, 0.6)
  Top 0.254: v61.09,41.15 61.09,42.61 C30.1 | R14.2 70.87,33.02 | R14.2 | R14.2 C23.2 v72.52,35.56 | IC11.7 70.75,43.44 v71.25,43.94 IC11.8
  Top 0.305: C31.2 59.18,42.16 60.2,41.15 v61.09,41.15 | IC9.5 64.9,32.64 v64.77,32.51 64.77,34.54 65.41,35.18 IC9.7
  Top 0.406: M1.- 97.03,43.53 97.03,43.56 97.54,44.07 97.54,47.62 C34.2 97.54,47.5 97.5,47.54 R24.1 | C36.2 77,49.57 76.96,49.53 R25.1 | C33.1 86.36,46.99 v85.09,48.26 | IC10.4 v85.72,39.37
  Top 0.61: C17.1 61.72,26.16 61.72,24.89 61.17,24.34 v60.03,24.34 59.5,23.82 IC8.1 | v64.77,41.15 C28.2
  Top 0.813: C25.2 v66.8,38.1 | C36.2 80.73,49.57 v80.77,49.53
  Bottom 0.254: v72.52,35.56 72.52,36.2
  Bottom 0.305: v64.77,32.51 65.02,32.26
  Bottom 0.406: v85.09,48.26 84.45,48.26 | v85.72,39.37 86.36,39.37
  Bottom 0.61: v64.77,41.15 64.52,41.15
  Bottom 0.813: v66.8,38.1 66.55,38.35 | v80.77,49.53 80.26,49.53
  pour Bottom: 100.33,52.07 100.33,38.1 74.68,38.1 74.68,24.13 59.69,24.13 59.69,44.83 62.23,44.83 62.23,45.72 74.93,45.72 74.93,52.07
ASENSE
  Top 0.254: 36.07,22.23 34.8,22.23 34.42,22.61 33.59,22.61 IC7.4
  Top 0.305: 40.64,19.58 40.81,19.41 IC5.3
  Top 0.61: R8.2 36.07,22.23 37.95,22.23 37.98,22.25 40.64,19.58
AUDIO
  Top 0.305: R19.1 | C32.1 59.35,44.96 C31.1 R19.1 | R19.1
BB+3V3  (via drill 0.51)
  Top 0.254: IC12.1 97.78,66.03 98.17,66.42 | 98.17,66.42 98.17,67.27 C38.1 | 98.17,66.42 98.55,66.04 99.31,66.04 99.56,65.79 IC12.14 | 95.12,55.88 95.25,55.88 | IC12.7 99.06,61.47 v99.82,60.71
  Top 0.406: 91.44,55.88 v91.44,60.33 89.28,62.48 R28.1 | 83.31,55.88 76.2,55.88 75.56,56.52 75.56,61.59 74.93,62.23 73.24,62.23 R26.1 | 83.31,55.88 91.44,55.88 | R27.1 82.93,62.48 83.19,62.23 83.19,56.01 83.31,55.88 | R32.2 81.92,73.28 85.09,70.1 85.09,68.48 85.63,67.94 87.5,67.94 | 87.5,67.94 90.17,67.94 SV2.15 | R33.2 87.21,70.78 87.63,70.36 87.63,68.07 87.5,67.94 | 91.44,55.88 95.12,55.88 | 95.25,55.88 v97.79,55.88 | SV2.15 96.14,66.67 96.52,67.06 97.96,67.06 C38.1 | SV2.15 91.44,65.15 92.33,64.26 95.12,64.26 95.76,63.63 95.76,62.57 R29.1
  Bottom 0.254: v97.79,55.88 98.68,55.88 99.82,57.02 v99.82,60.71
  Bottom 0.406: v91.44,60.33 SV2.15
BBBLUE  (via drill 0.51)
  Top 0.406: R34.1 69.56,73.44 71.63,71.37 71.63,69.09 72.77,67.94 80.01,67.94 SV2.8 | R35.1 90.55,74.3 89.41,75.44 v81.28,75.44
  Bottom 0.406: SV2.8 v81.28,75.44
BBBOT
  Top 0.305: JP6.1 86.36,62.48 R28.2 86.53,63.97 SV2.9
BBBYP  (via drill 0.51)
  Top 0.254: IC12.2 97.04,64.13 96.77,64.39 96.77,65.15 v96.39,65.53
  Top 0.305: v98.3,59.31 99.95,59.31 100.33,58.93 C37.1
  Bottom 0.305: v98.3,59.31 96.39,61.21 v96.39,65.53
BBEYE
  Top 0.305: J9.SIG 69.34,64.14 70.23,65.02 74.55,65.02 SV2.3
BBGND  (via drill 0.51)
  Top 0.254: IC12.12 101.08,64.13 101.09,64.14 | 101.09,64.14 101.09,63.12 101.08,63.13 IC12.10 | 101.09,64.14 101.09,67.31 C38.2 99.91,68.8 v99.95,68.83 | IC12.5 97.78,61.97 v97.41,61.59
  Top 0.406: C37.2 99.15,55.79 98.93,56.01 98.93,56.64 97.16,58.42 JP7.2
  pour Bottom: 72.39,55.12 72.39,60.96 77.47,60.96 77.47,78.23 101.35,78.23 101.35,55.12
BBGRN
  Top 0.406: R39.1 64.77,80.26 69.98,80.26 72.01,78.23 75.69,78.23 | 75.69,78.23 75.69,72.26 SV2.6 | R37.1 91.02,77.89 88.77,80.14 76.58,80.14 75.69,79.25 75.69,78.23
BBLEFT
  Top 0.305: JP7.1 93.98,62.48 R29.2 90.55,62.48 SV2.11
BBPHFACE
  Top 0.305: 85.34,73.44 R33.1 85.51,72.48 86.36,71.63 SV2.12
  Bottom 0.254: JP9.1 85.09,72.26 86.36,70.99 SV2.12
BBPHTOP
  Top 0.305: JP8.1 77.47,74.93 77.72,74.68 77.72,73.44 R32.1 77.89,72.73 78.74,71.88 81.15,71.88 SV2.10
BBRED  (via drill 0.51)
  Top 0.305: R38.1 99.23,79.59 98.81,80.01 94.74,80.01 93.98,80.77 74.68,80.77 v73.15,79.25
  Top 0.406: SV2.4 73.03,72.39 R36.1 74.33,75.35 v74.42,75.44
  Bottom 0.406: v73.15,79.25 74.42,77.98 v74.42,75.44
BBRT
  Top 0.305: JP5.1 78.74,62.48 R27.2 78.91,64.3 SV2.7
BBSCL  (via drill 0.51)
  Top 0.254: v93.34,65.53 94.87,65.53 96.77,63.63 96.77,63.37 97.03,63.12 97.78,63.12 IC12.4 | SV2.14 90.68,70.99 92.46,70.99 93.34,70.1 v93.34,67.82
  Bottom 0.254: v93.34,65.53 v93.34,67.82
BBSDA
  Top 0.254: SV2.13 92.08,63.5 94.87,63.5 95,63.37 95,61.47 95.76,60.71 98.01,60.71 98.55,61.24 IC12.6
BBTOP
  Top 0.305: JP4.1 71.12,62.32 R26.2 71.29,63.67 71.75,64.14 76.2,64.14 SV2.5
BBVMOTOR
  Top 0.813: J9.PWR SV2.1
BBVSS
  Bottom 0.61: 75.44,80.52 arc90 74.93,80.01
  Bottom 0.813: LED2.2 97.16,78.74 95.38,80.52 75.44,80.52
  pour Bottom: 63.5,64.14 63.5,81.28 75.56,81.28 75.56,64.14
BLUE  (via drill 0.51)
  Top 0.254: U2.10 62.23,5.33 38.35,5.33 38.1,5.08 35.56,5.08 35.05,4.57 v34.54,4.57
  Bottom 0.254: SV1.8 35.81,28.96 35.81,9.91 34.54,8.64 v34.54,4.57
BSENSE
  Top 0.254: IC4.4 34.33,14.95 34.67,14.61 35.96,14.61 R5.2
  Top 0.305: 40.64,17.42 40.68,17.46 IC5.6
  Top 0.61: R5.2 37.72,14.5 40.64,17.42
DACOUT  (via drill 0.6)
  Top 0.305: R19.2 57.15,42.42 59.94,39.62 v61.98,39.62 | IC9.8 64.9,36.45 v64.01,35.56
  Bottom 0.305: v64.01,35.56 62.99,35.56 62.74,35.81 62.74,38.86 v61.98,39.62
DACVREF
  Top 0.254: R15.2 69.09,38.1 69.13,38.06 C23.1 69.13,34.04 R14.1 | R14.1 69.09,33.02 | R14.1
  Top 0.305: IC9.6 69,33.91 69.13,34.04
DASCK  (via drill 0.51)
  Top 0.254: IC9.3 60.58,33.91 55.37,39.12 55.37,40.64 54.36,41.66 54.36,46.23 53.34,47.24 3.81,47.24 v3.56,46.99
  Bottom 0.254: U2.35 1.78,20.32 1.02,21.08 1.02,46.99 1.78,47.75 2.54,47.75 3.3,46.99 v3.56,46.99
DASDI  (via drill 0.51)
  Top 0.254: IC9.4 60.58,32.64 54.86,38.35 54.86,40.13 53.85,41.15 53.85,45.97 53.09,46.74 12.19,46.74 v9.91,44.45
  Bottom 0.254: U2.36 6.35,24.13 3.3,24.13 2.79,24.64 2.79,43.94 3.3,44.45 v9.91,44.45
ENVELOPE
  Top 0.254: R25.2 76.96,51.31 76.92,51.27 76.92,51.05 74.68,51.05 70.36,46.74 56.39,46.74 54.36,48.77 36.07,48.77 35.56,49.28 U2.A6
  Top 0.305: 82.55,48.77 D5.C 82.55,50.55 81.83,51.27 C36.1 76.92,51.27 76.75,51.27 76.71,51.31 R25.2
EYE
  Top 0.254: SV1.3 34.54,37.85 27.69,37.85 27.43,38.1 24.38,38.1 23.37,37.08 21.34,37.08 19.05,34.8 13.21,34.8 12.45,35.56 U2.46
FWDLEFT  (via drill 0.51)
  Top 0.254: v47.24,14.54 47.24,14.48 47.86,15.09 IC5.9
  Bottom 0.254: U2.2 44.7,4.06 44.7,12.95 46.28,14.54 v47.24,14.54
FWDRT  (via drill 0.51)
  Top 0.254: 48.01,20.71 IC5.16 | v48.01,21.59 48.01,20.71 | 48.01,20.71 48.02,20.71
  Bottom 0.254: v48.01,21.59 48.13,21.72 49.76,21.72 50.16,21.32 50.16,6.48 51.05,5.59 54.1,5.59 55.88,3.81 U2.7
GND  (via drill 0.51, 0.6, 0.8)
  Top 0.254: IC2.12 70.22,8.76 v70.36,8.89 70.36,8.26 69.86,7.75 IC2.10 | IC2.7 v67.82,5.84 | IC3.1 12.36,14.26 12.57,14.48 v12.57,14.86 | v60.71,8.76 C3.2 | C4.2 v71.25,11.3 | IC2.5 65.55,7.25 v65.15,6.86 | C24.2 18.45,35.98 v18.8,36.32
  Top 0.305: v49.78,29.34 R12.2
  Top 0.406: C2.2 95.67,8.68 95.89,8.89 97.9,8.89 | C1.2 1.91,4.3 v1.91,5.97 | C26.2 v45.97,39.37 | IC7.2 32.11,23.52 v32.26,23.37 | C14.2 34.14,20.98 v34.54,20.57 | IC4.2 32.11,15.9 v32.26,15.75 | C5.2 34.14,13.36 v34.54,12.95 | C22.2 v34.54,28.19 | C18.2 21.76,24.22 v21.84,24.13
  Top 0.61: IC6.1 59.62,20.39 v59.69,20.32 | C10.1 59.65,20.28 v59.69,20.32 | C21.1 57.11,29.17 v57.15,29.21 | C35.2 61.76,49.11 60.83,50.04 60.83,50.67 U2.GND@0 | 98.04,9.19 v98.04,11.18 | 98.04,9.19 U1.GP 98,8.89 97.9,8.89 | 98.04,9.19 98.04,9.14 | U1.GP3 80.26,34.69 v80.26,34.54 | U1.6 78.09,17.39 v78.74,18.03 | U1.3 78.49,24.89 v78.74,24.64 | C19.1 51.02,27.52 v51.18,27.69 51.35,27.52 C20.1 | C6.2 53.65,14.02 v53.59,13.97 | C15.2 61.3,20.32 v59.69,20.32 | C16.2 69.76,20.49 68.96,19.68 C12.-
  Top 1.27: v15.49,18.54 v21.08,18.54
  Top 1.778: v34.54,28.19 v41.15,28.19
  Bottom 0.254: v70.36,8.89 70.36,9.53 | v71.25,11.3 71.12,11.3 | v18.8,36.32 19.05,36.58
  Bottom 0.406: v45.97,39.37 46.23,39.37 | v32.26,23.37 32.77,23.37 | v34.54,20.57 34.8,20.57 | v32.26,15.75 32.51,15.75 | v34.54,12.95 35.05,12.95 | v21.84,24.13 21.84,23.88
  Bottom 0.61: v57.15,29.21 55.88,29.21 | v80.26,34.54 80.77,34.54 | v78.74,18.03 79.25,18.03 | v78.74,24.64 78.74,24.13 | v53.59,13.97 53.59,13.72
  Bottom 1.27: J1.4 17.78,7.87 18.8,8.89
  other vias: 18.54,18.54
  pour Bottom: 0,0.51 34.54,0.51 34.54,25.65 50.29,25.65 50.55,0.51 101.6,0.51 101.6,35.56 76.2,35.56 76.2,23.11 58.93,23.11 58.8,46.99 73.03,46.99 73.03,53.34 0,53.34
GRN  (via drill 0.51)
  Top 0.254: U2.9 62.48,4.32 62.23,4.57 39.12,4.57 38.86,4.32 36.07,4.32 v35.81,4.06
  Bottom 0.254: SV1.6 36.32,30.99 36.32,9.14 35.81,8.64 v35.81,4.06
IR+5V
  Top 0.406: IC1.3 C2.1 R1.1 | R1.1
IRIN  (via drill 0.51)
  Top 0.254: 88.52,4.83 63.75,4.83 62.48,6.1 37.59,6.1 37.08,5.59 33.53,5.59 32.51,4.57 v17.53,4.57
  Top 0.305: IC1.1 92.08,1.27 88.52,4.83
  Bottom 0.254: v17.53,4.57 16.51,5.59 16.51,23.11 14.99,24.64 14.99,36.58 13.46,38.1 U2.48
LCURRENT  (via drill 0.51)
  Top 0.254: R10.2 27.18,27.69 28.19,27.69 28.45,27.94 28.45,28.19 | 28.45,28.19 v28.45,28.96 | 28.45,28.19 C22.1
  Bottom 0.254: U2.A8 27.94,29.46 v28.45,28.96
LEFT+
  Top 0.305: C8.2 28.45,17.17 | 39.57,18.11 IC5.5
  Top 0.61: 39.57,18.11 38.99,18.69 29.11,18.69 28.45,18.03 C8.2 | C8.2 28.45,16.85 | J2.2 25.91,17.14 26.3,16.75 C8.2
LEFT-
  Top 0.305: 40.89,16.38 40.89,16.51 41.2,16.82 IC5.7
  Top 0.61: 40.89,16.38 39.37,14.86 39.37,14.61 36.58,11.81 29.84,11.81 28.45,13.21 C8.1 | C8.1 28.45,14.99 | J2.1 25.91,14.61 26.35,15.05 C8.1
LIOUT  (via drill 0.51)
  Top 0.254: IC7.1 30.06,24.47 29.72,24.13 29.72,23.88 v29.46,23.62 | v26.67,23.62 25.4,24.89 R9.1
  Bottom 0.254: v26.67,23.62 v29.46,23.62
MIC  (via drill 0.51)
  Top 0.254: 79.38,43.18 78.49,44.07 v78.49,44.7 | v72.14,50.04 69.6,52.58 39.88,52.58 U2.A5
  Top 0.305: R17.1 | R17.1 79.25,41.91 | R17.1 C27.1 | IC10.6 87,40.64 85.09,42.55 85.09,43.81 83.82,45.09 D5.A 81.28,45.09 79.38,43.18 79.38,42.1 R17.1
  Bottom 0.305: v78.49,44.7 74.17,49.02 73.15,49.02 v72.14,50.04
MIC+
  Top 0.305: M1.+ 96.2,41.59 95.25,42.55 C29.2 93.56,44.98 R22.1
MICOP+  (via drill 0.6)
  Top 0.305: C34.1 95.89,47.62 95.8,47.71 R24.2 92.71,50.16 92.39,49.84 R23.1 92.84,49.91 92.77,49.84 91.63,49.84 89.53,47.75 v89.53,46.35 | IC10.3 v85.09,40.64
  Bottom 0.305: v85.09,40.64 85.09,41.91 85.22,42.04 v89.53,46.35
MICOP-
  Top 0.305: R16.1 93.6,40.01 93.66,39.94 93.66,39.05 92.71,38.1 81.28,38.1 80.77,38.61 80.77,40.01 C27.2 R17.2 | R17.2 80.9,41.91 R17.2 | R17.2 IC10.2
MOTFAULT  (via drill 0.51)
  Top 0.254: IC5.8 42.06,15.6 42.67,14.99 44.96,14.99 v46.74,13.21
  Bottom 0.254: U2.6 51.56,0.76 49.78,0.76 49.53,1.02 49.53,3.3 47.75,5.08 47.75,12.19 v46.74,13.21
MOTSLEEP  (via drill 0.51)
  Top 0.254: IC5.1 42.06,21.48 42.42,21.84 v46.74,21.84
  Bottom 0.254: v46.74,21.84 47.12,21.46 47.12,20.7 47.37,20.45 48.13,20.45 48.77,19.81 48.77,5.59 50.8,3.56 U2.5
MOTVINT
  Top 0.254: IC5.14 49.26,19.41 50.8,20.95 51.2,20.95 C11.1
N$1
  Top 0.305: 48.77,17.42 48.73,17.46 IC5.11
  Top 0.406: C9.2 51.31,15.11 51.31,14.95 50.1,14.95 49.66,15.39 49.66,16.54 48.77,17.42
N$4
  Top 0.254: IC3.7 IC3.8 14.77,14.26 14.99,14.48 14.99,14.99 15.24,15.24 15.66,15.24 R4.2
N$7
  Top 0.406: LED1.3 65.33,76.5 64.77,75.95 R34.2
N$8
  Top 0.406: R39.2 66.33,78.53 LED1.4
N$9
  Top 0.406: LED1.1 71.17,76.5 71.63,76.96 72.94,76.96 R36.2
N$10
  Top 0.254: IC2.2 64.1,8.76 C3.1
N$53
  Top 0.305: C29.1 91.86,40.1 R16.2
N$61
  Top 0.61: LED2.3 95.63,75.82 94.23,74.42 93.18,74.42 R35.2
N$64
  Top 0.61: LED2.4 94.28,78.44 93.22,79.5 92.16,79.5 R37.2
N$65
  Top 0.61: LED2.1 100.12,76.5 100.33,76.71 R38.2
PHOTOFACE  (via drill 0.51)
  Top 0.254: v26.67,37.08 26.92,37.08 27.94,36.07 27.94,34.29 SV1.12
  Bottom 0.254: U2.A7 32.51,50.8 30.99,52.32 27.18,52.32 26.67,51.82 v26.67,37.08
PHOTOLEFT  (via drill 0.51)
  Top 0.254: JP3.1 34.54,43.94 34.71,44.11 R21.1 42.84,44.11 v42.93,44.2
  Bottom 0.254: v42.93,44.2 42.93,46.23 45.72,49.02 U2.A2
PHOTORT  (via drill 0.51)
  Top 0.254: JP2.1 22.86,43.69 23.11,43.94 23.96,43.94 R20.1 27.01,44.11 29.21,41.91 34.54,41.91 35.56,42.93 41.15,42.93 v41.4,43.18
  Bottom 0.254: v41.4,43.18 41.4,47.5 43.18,49.28 U2.A3
PHOTOTOP
  Bottom 0.254: U2.A4 38.86,52.58 35.31,52.58 34.29,51.56 34.29,49.02 34.04,48.77 29.46,48.77 29.21,48.51 29.21,37.59 30.48,36.32 30.48,33.78 29.72,33.02 SV1.10
RANGE
  Bottom 0.254: J5.2 U2.A1
RANGE+5V
  Top 0.406: C26.1 FB1.1 51.22,40.98 50.8,41.4 50.8,42.55 J5.1
RCURRENT  (via drill 0.51)
  Top 0.254: C18.1 23.37,26.25 v23.37,27.94 23.79,27.52 R9.2
  Bottom 0.254: U2.A9 25.4,29.97 v23.37,27.94
RED
  Bottom 0.254: SV1.4 36.83,3.56 36.32,3.05 36.32,1.52 36.83,1.02 46.74,1.02 U2.4
REVLEFT  (via drill 0.51)
  Top 0.254: IC5.10 48.59,16.82 48.9,16.51 48.9,12.83 48.26,12.19 v45.72,12.19
  Bottom 0.254: U2.3 v45.72,12.19
REVRT  (via drill 0.51)
  Top 0.254: IC5.15 48.51,20.07 v49.28,20.83
  Bottom 0.254: v49.28,20.83 49.28,6.1 50.8,4.57 53.85,4.57 54.61,3.81 54.61,1.52 55.37,0.76 58.17,0.76 U2.8
RIGHT+
  Top 0.305: 40.89,20.6 41.43,20.07 IC5.2
  Top 0.61: 40.89,20.6 39.37,22.12 39.37,25.2 38.33,26.24 30.53,26.24 28.45,24.16 C13.1 28.43,21.84 26.16,21.84 25.78,22.23 J2.4
RIGHT-
  Top 0.305: 40.13,18.82 40.19,18.77 IC5.4
  Top 0.61: C13.2 28.45,20.07 | 40.13,18.82 39.37,19.58 30.1,19.58 29.65,20.03 28.45,20.03 C13.2 | J2.3 25.91,19.68 26.35,20.13 C13.2
RIOUT  (via drill 0.51)
  Top 0.254: IC4.1 30.96,17.5 31.24,17.78 32,17.78 v32.26,17.53 | v28.7,25.91 28.7,25.82 R10.1
  Bottom 0.254: v32.26,17.53 31.24,18.54 31.24,23.37 v28.7,25.91
SCL3V3  (via drill 0.51)
  Top 0.254: IC2.4 64.91,7.75 64.52,7.37 36.07,7.37 35.56,6.86 27.94,6.86 27.18,6.1 13.72,6.1 v13.08,6.73 | v12.57,11.81 12.57,12.7 12.06,13.21 IC3.3 10.67,13.21 10.54,13.34 10.54,15.97 10.82,16.26 R6.1 12.7,16.26 12.7,18.8 v13.59,19.68 | v13.46,31.37 22.48,31.37 SV1.14
  Bottom 0.254: v13.08,6.73 13.08,11.3 v12.57,11.81 | v13.59,19.68 13.59,31.24 v13.46,31.37
SCL5V  (via drill 0.51)
  Top 0.254: R3.1 15.24,13.72 14.74,13.21 IC3.6 13.57,13.21 13.21,12.85 13.21,12.45 v14.22,11.43
  Bottom 0.254: U2.21 15.11,2.54 14.22,3.43 v14.22,11.43
SDA3V3  (via drill 0.51)
  Top 0.254: IC2.6 67.32,6.49 66.8,5.97 64.26,5.97 63.63,6.6 36.83,6.6 36.58,6.35 30.73,6.35 29.97,5.59 v12.19,5.59 | v11.43,11.68 11.45,11.81 IC3.4 10.51,12.66 10.03,13.14 10.03,17.5 10.44,17.91 R7.1 11.85,19.22 v11.94,19.3 | v11.94,34.29 22.86,34.29 SV1.13
  Bottom 0.254: v12.19,5.59 11.43,5.59 v11.43,11.68 | v11.94,19.3 v11.94,34.29
SDA5V  (via drill 0.51)
  Top 0.254: v15.24,10.54 15.91,11.21 R2.1 15.11,11.94 14.99,12.06 14.99,12.45 14.77,12.66 IC3.5
  Bottom 0.254: U2.20 15.24,5.08 v15.24,10.54
SDCS
  Top 0.254: R18.1 2.58,43.43 3.56,43.43 3.81,43.18 U2.53 6.35,44.45 8.38,44.45 11.43,41.4 41.66,41.4 44.96,38.1 52.58,38.1 59.69,30.99 70.87,30.99 71.97,29.89 U1.1
SDDI  (via drill 0.51)
  Top 0.254: v10.16,40.89 41.4,40.89 46.74,35.56 54.1,35.56 59.44,30.23 69.09,30.23 71.93,27.39 U1.2
  Bottom 0.254: v10.16,40.89 9.14,41.91 6.35,41.91 U2.51
SDDO  (via drill 0.51)
  Top 0.254: v18.8,10.92 20.07,12.19 25.15,12.19 27.69,9.65 54.36,9.65 56.13,11.43 63.25,11.43 66.7,14.89 U1.7
  Bottom 0.254: v18.8,10.92 17.53,12.19 17.53,26.92 17.02,27.43 17.02,28.7 15.75,29.97 15.75,38.86 14.73,39.88 8.38,39.88 U2.50
SDSCLK
  Top 0.254: U2.52 9.14,41.66 9.14,40.39 9.65,39.88 10.92,39.88 11.43,40.39 40.64,40.39 45.21,35.81 45.21,35.05 47.24,33.02 55.63,33.02 59.18,29.46 68.83,29.46 72.14,26.16 80.01,26.16 80.52,25.65 80.52,20.57 79.83,19.89 U1.5
SPK+
  Top 0.254: IC11.10 70.99,44.94
  Top 0.305: 70.99,44.94 70.99,44.96 71.25,45.21
  Top 0.61: 71.25,45.21 J6.2
SPK-
  Top 0.254: IC11.6 71.25,42.94 71.25,42.67
  Top 0.61: 71.25,42.67 J6.1
SPKDRV+
  Top 0.254: IC11.4 64.27,43.44 63.75,42.93 63.21,42.93 C30.2
SPKDRV-
  Top 0.254: IC11.2 63.05,44.44 C32.2
SPKTBASE
  Top 0.61: R30.2 10.16,66.67 10.79,67.31 12.7,67.31 R31.2 11.26,69 Q1.1
SPT+
  Top 0.61: J7.1 D6.1 7.42,62.87 5.08,62.87 C39.+
SPT-
  Top 0.61: J7.3 12.7,62.23 15.88,65.41 15.88,69.22 14.61,70.48 12.91,70.48 R31.1 11.26,70.7 Q1.2
SPTPWM
  Top 0.61: J7.2 R30.1
SPTSPK+
  Top 0.61: C39.- 5.08,73.03 6.99,74.93 J10.2
SPTSPK-
  Top 0.61: 8.26,69.85 7.62,69.22 D6.2 | 8.26,69.85 Q1.3 | 8.26,69.85 7.62,70.48 7.62,71.12 8.26,71.75 8.89,71.75 10.16,73.03 10.79,73.03 11.43,73.66 J10.1
TILTBACK  (via drill 0.51)
  Top 0.254: v39.12,38.35 38.35,39.12 12.95,39.12 10.67,36.83 3.81,36.83 3.3,36.32 3.3,34.8 U2.45
  Bottom 0.254: J4.SIG 50.8,35.56 46.74,35.56 45.72,36.58 40.89,36.58 v39.12,38.35
TILTFRONT  (via drill 0.51)
  Top 0.254: v41.15,38.1 39.62,39.62 12.19,39.62 11.94,39.37 4.06,39.37 2.29,37.59 2.29,32.51 3.05,31.75 6.35,31.75 U2.44
  Bottom 0.254: J3.SIG 47.24,36.83 46.74,37.34 41.91,37.34 v41.15,38.1
TOUCHBOT
  Top 0.254: SV1.9 30.48,34.29 30.48,32.26 29.72,31.5 26.16,31.5 24.89,30.23 20.94,30.23 19.05,28.34 15.1,24.38 13.97,24.38 11.18,21.59 3.56,21.59 3.05,21.08 3.05,14.73 U2.29
TOUCHLEFT
  Top 0.254: SV1.11 25.4,34.29 25.4,32.36 23.77,30.73 20.44,30.73 18.29,28.58 18.29,28.56 14.87,25.15 9.91,25.15 8.89,24.13 3.05,24.13 2.03,23.11 2.03,12.7 3.3,11.43 6.35,11.43 U2.28
TOUCHRT
  Top 0.254: SV1.7 33.02,34.29 33.02,32.26 31.5,30.73 26.42,30.73 25.15,29.46 21.27,29.46 19.56,27.76 15.42,23.62 14.48,23.62 9.14,18.29 9.14,16.76 U2.30
TOUCHTOP  (via drill 0.51)
  Top 0.254: SV1.5 35.56,34.29 35.56,32 33.53,29.97 26.67,29.97 25.65,28.96 22.1,28.96 v15.24,22.1
  Bottom 0.254: U2.31 6.35,16.51 8.89,16.51 10.41,18.03 13.46,18.03 15.24,19.81 v15.24,22.1
VIN  (via drill 0.51, 0.81)
  Top 0.305: 55.41,29.46 R13.1
  Top 0.61: C20.2 53.13,25.95 D3.1 54.61,24.13 | 54.61,24.13 54.61,24.77 54.86,24.77 | 54.86,24.77 IC8.3 | D2.2 54.41,22.66 54.61,22.86 54.61,24.13 | 54.86,24.77 54.86,25.78 55.41,26.33 C21.2 55.41,29.46 | v56.9,30.48 56.05,29.63 R13.1
  Top 0.813: U2.VIN 55.88,50.04 v58.17,47.75
  Bottom 0.813: v56.9,30.48 58.17,31.75 v58.17,47.75
VINSENSE  (via drill 0.51)
  Top 0.254: 52.92,30.06 52.5,30.48 49.78,30.48 48.77,29.46 47.5,29.46 39.88,37.08 38.35,37.08 36.83,38.61 23.37,38.61 v22.86,38.1 16.76,38.1 16.26,37.59 14.31,37.59 C24.1
  Top 0.305: R12.1 52.92,30.06 54.1,31.24 55.24,31.24 R13.2
  Bottom 0.254: v22.86,38.1 U2.A10
VMOTOR
  Top 0.305: 48.77,18.11 48.79,18.11 IC5.12
  Top 0.508: 48.77,18.11 50.72,18.11 51.05,17.78 51.05,17 C9.1
  Top 0.61: 51.05,16.75 C9.1 51.37,16.85 51.31,16.76 | 46.35,24.13 D3.2 | C19.2 47.41,25.82 JP1.1
  Top 0.813: JP1.1 46.35,24.13 47.62,22.86 52.07,22.86 52.83,22.1 52.83,16.89 52.69,16.75 C9.1
  Top 1.016: J3.PWR J4.PWR | JP1.1 45.72,29.21 SV1.1
  Bottom 1.016: J3.PWR 46.35,34.29 45.09,35.56 SV1.1
VSS  (via drill 0.51, 0.6)
  Top 0.254: 36.04,17.27 34.8,17.27 34.42,16.89 33.6,16.89 IC4.5 | R8.1 34.7,24.92 34.29,24.51 33.6,24.51 IC7.5 | IC5.13 46.26,18.77 v45.72,19.3 45.72,19.2 IC5.EXP
  Top 0.305: IC5.EXP 44.48,18.44 | 44.58,18.41 44.7,18.41 | C11.2 50.99,19.05 49.66,19.05 49.37,18.77 IC5.13
  Top 0.61: v38.23,24.64 37.85,25.02 36.17,25.02 R8.1 36.07,25.02 | v38.23,17.3 38.1,17.3 R5.1 36.04,17.27
  Top 0.813: 44.48,18.44 44.5,18.41 44.58,18.41
  Top 1.016: J3.GND J4.GND
  Bottom 0.61: v38.23,24.64 38.1,24.51
  Bottom 0.813: JP1.2
  Bottom 1.016: JP1.2 R101.2 | J3.GND 46.23,31.75 44.96,33.02 SV1.2
  Bottom 1.27: 38.23,24.13 v38.23,24.64 38.23,31.88 SV1.2
  other vias: 45.72,17.27 44.2,16.26 44.2,20.32 44.2,18.41
  pour Bottom: 37.59,24.64 49.02,24.64 49.28,4.83 37.59,4.83
WF+3V3  (via drill 0.51)
  Top 0.61: J8.1 C40.1 40.96,75.25 v41.27,75.56
  Bottom 0.61: v41.27,75.56 50.91,75.56 U3.1
WFGND
  Top 0.61: U3.10 34.49,77.15 C40.2 22.54,77.15 21.59,76.2 21.59,67.31 J8.4
WFWIFIRX
  Top 0.61: J8.3 40.66,67.31 U3.2
WFWIFITX
  Top 0.61: J8.2 41.2,69.85 U3.3
WIFIRX
  Bottom 0.254: U2.19 J1.3
WIFITX
  Bottom 0.254: U2.18 J1.2

### Text on the board
Top: TOP
Bottom: BOTTOM
tPlace: WiFly Carrier | Eye | Audio PWM Test | range | photo rt | photo left | speaker | microphone | Front | Back | 7.5V | battery | motors | Romibo Shield Rev 3 | accelerometer | WiFi | copyright (c) 2012 Origami Robotics LLC | IR
bPlace: Photo | Top | Face | Romibo Head Rev 3 | Switch | Top | Rt | Bot | Left
Reference: Romibo | Origami Robotics
_tsilk: R17 | R15 | R16 | LED2 | Sig | GND | Vcc | LED1 | JP8 | JP4 | JP5 | JP7 | R18 | R6 | R5 | R4 | JP6 | J1 | R19 | C8 | C16 | C15 | Vcc | SIG | IC1 | J5 | JP2 | C14 | JP3 | JP1 | R13 | GND | C1 | IC4 | IC5 | R20 | R14 | R7 | C2 | IC6 | C13 | R9 | .1uF | C12 | R8 | R10 | U$8 | MOTORS | BATTERIES | C3 | R11 | C7 | S1 | C10 | R12 | S2 | JP11 | JP10 | IC2 | 1 | 2 | C6 | JP9 | Vcc | Vout | C5 | R1 | R2 | R3 | C11 | C4